# EasyEDA Pro project busmaster-v102.eprj, board base-board
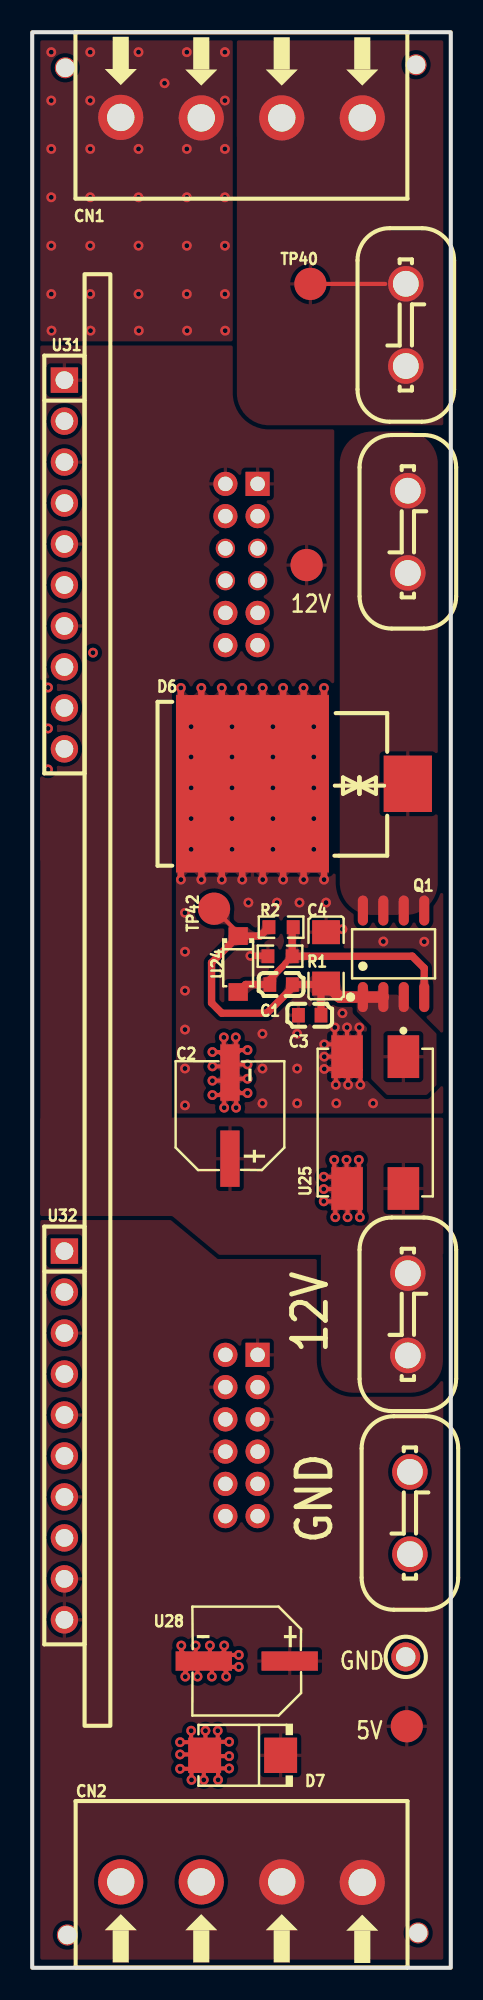
[diagram p5: board, top side]
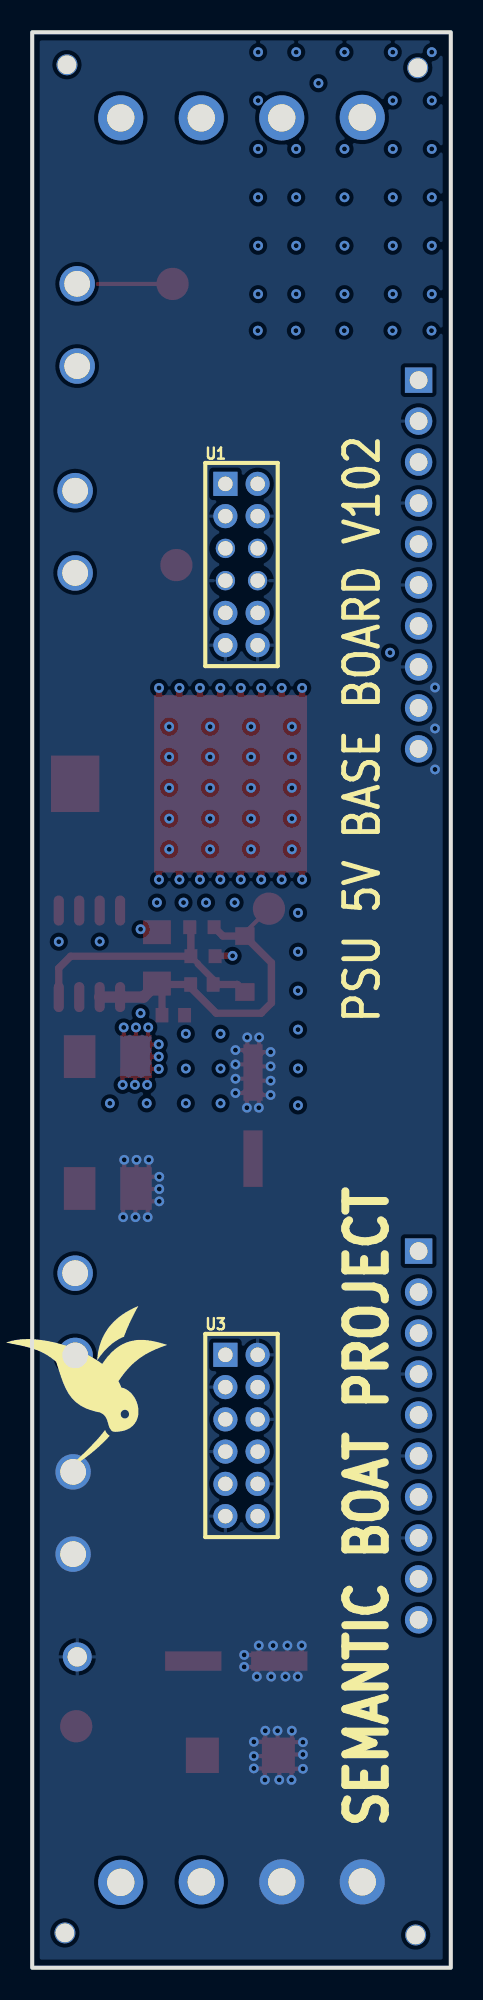
[diagram p6: board, bottom side, seen from below]

Outline 26 x 120 mm; copper layers: Top Layer, Inner1, Inner2, Bottom Layer. Coordinates in mm from the lower left corner of the outline.
Outline path: rectangle 0,120 26,0
Stack: Top Layer 0.07mm Outer layer thickness 1oz / Dielectric1 0.2104mm 7628 RC49% 8.6mil / Inner1 0.0152mm Inner layer thickness / Dielectric2 1.065mm 1.1mm H/HOZ Copper / Inner2 0.0152mm Inner layer thickness / Dielectric3 0.2104mm 7628 RC49% 8.6mil / Bottom Layer 0.07mm Outer layer thickness 1oz

## Design rules (mm)
template: Custom Config
spacing copperThickness1oz: track to track 0.102, other pairs 0.152 to 0.3
spacing copperThickness2oz (default): track to track 0.203, other pairs 0.152 to 0.3
spacing copperThicknessInner0.5oz: track to track 0.089, other pairs 0.152 to 0.3
track width copperThickness1oz: min 0.102, default 0.254, max 2.54
track width copperThickness2oz (default): min 0.203, default 0.254, max 2.54
track width copperThickness0.5oz: min 0.089, default 0.254, max 2.54
differential pair differentialPair (default): width min 0.127, default 0.254, max 2.54; gap min 0.152, default 0.152
via viaSize (default): diameter min 0.3, default 0.61, max 10; hole min 0.2, default 0.305, max 6.3

## Placement (name value [footprint] x y rotation side)
C1  100nF  [C0603]  15.46 60.96 180 top
C2  100uF  [CAP-SMD_BD6.3-L6.6-W6.6-LS7.6-RD]  12.28 52.83 90 top
C3  100nF  [C0603]  17.24 59.06 180 top
C4  10uF  [C1206]  18.25 62.61 270 top
CN1  WJ128V-5.0-4P  [CONN-TH_4P-P5.00_WJ128V-4P-5.0-14-00A]  13 114.71 180 top
CN2  WJ128V-5.0-4P  [CONN-TH_4P-P5.00_WJ128V-4P-5.0-14-00A]  13 5.31 0 top
D6  SM8S20CA  [DO-218AB_L13.5-W8.4-LS15.5-BI]  18.5 73.41 0 top
D7  SMBJ5.0A  [SMB_L4.6-W3.6-LS5.3-RD]  13.07 13.17 180 top
NOREF  -  [Pad_e17]  2.06 117.8 270 top
NOREF#2  -  [Pad_e16]  23.97 2.16 90 top
NOREF#3  -  [Pad_e19]  23.84 117.98 180 top
NOREF#4  -  [Pad_e14]  2.18 2.03 0 top
Q1  IRF7240TRPBF-JSM  [SOIC-8_L4.9-W4.0-P1.27-LS6.0-BL]  22.44 62.86 0 top
R1  47kΩ  [R0603]  15.39 62.71 0 top
R2  100kΩ  [R0603]  15.46 64.52 180 top
TP8  RH-5004  [TESTPOINT_TH_BD2.5-D1.2]  23.2 19.27 0 top
TP38  -  [Test-Point-0.5mm]  17.04 86.97 0 top
TP39  -  [Test-Point-0.5mm]  23.27 14.97 0 top
TP40  -  [Test-Point-0.5mm]  17.28 104.4 0 top
TP42  -  [Test-Point-0.5mm]  11.29 65.66 0 top
U1  2005FV-2x6P  [HDR-TH_12P-P2.00-V-F-R2-C6-S2.00]  13 87 270 bottom
U3  2005FV-2x6P  [HDR-TH_12P-P2.00-V-F-R2-C6-S2.00#2]  13 33 270 bottom
U4  G630-09-3T  [CONN-TH_2P-L8.2-W0.8-P5.10]  23.21 101.85 270 top
U5  G630-09-3T  [CONN-TH_2P-L8.2-W0.8-P5.10]  23.33 89.03 90 top
U24  BZT52C15  [SOD-123_L2.7-W1.6-LS3.8-RD]  12.79 62.23 270 top
U25  ACM9070-701-2PL-TL01  [FILTER-SMD_4P-L9.0-W7.0-TL]  21.31 52.4 270 top
U28  330uF  [CAP-SMD_BD6.3-L6.6-W6.6-LS7.4-FD]  13.32 19.01 180 top
U31  PM254-1-10-Z-8.5  [HDR-TH_10P-P2.54-V-F]  2 87 270 top
U32  PM254-1-10-Z-8.5  [HDR-TH_10P-P2.54-V-F]  2 33 270 top
U33  G630-09-3T  [CONN-TH_2P-L8.2-W0.8-P5.10]  23.33 40.51 90 top
U34  G630-09-3T  [CONN-TH_2P-L8.2-W0.8-P5.10]  23.46 28.19 90 top

## Footprints (pads in the part's own frame, mm; a bottom-side part is the same pattern mirrored in y, then rotated)
C0603
  rect 0.8x0.9 smd: 1(-0.7,0) 2(0.7,0)
C1206
  rect 1.485x1.728 smd: 1(-1.593,0) 2(1.593,0)
CAP-SMD_BD6.3-L6.6-W6.6-LS7.4-FD
  rect 3.5x1.2 smd: 1(-2.67,0) 2(2.67,0)
CAP-SMD_BD6.3-L6.6-W6.6-LS7.6-RD
  rect 3.5x1.2 smd: 1(-2.67,0) 2(2.67,0)
CONN-TH_2P-L8.2-W0.8-P5.10
  round 2.2 hole 1.6: 1(-2.55,0) 2(2.55,0)
CONN-TH_4P-P5.00_WJ128V-4P-5.0-14-00A
  round 2.8 hole 1.7: 1(-7.5,0.015) 2(-2.5,0.015) 3(2.5,0.015) 4(7.5,-0.015)
DO-218AB_L13.5-W8.4-LS15.5-BI
  rect 9.5x11 smd: 1(-4.825,0)
  rect 3x3.5 smd: 2(4.825,0)
FILTER-SMD_4P-L9.0-W7.0-TL
  rect 2.65x1.96 smd: 1(-4.088,1.75) 2(-4.088,-1.75) 3(4.088,-1.75) 4(4.088,1.75)
HDR-TH_10P-P2.54-V-F
  rect 1.575x1.7 hole 1.1: 1(-11.43,0)
  round 1.7 hole 1.1: 2(-8.89,0) 3(-6.35,0) 4(-3.81,0) 5(-1.27,0) 6(1.27,0) 7(3.81,0) 8(6.35,0) 9(8.89,0) 10(11.43,0)
HDR-TH_12P-P2.00-V-F-R2-C6-S2.00
  rect 1.5x1.5 hole 0.9: 1(-5,-1)
  round 1.5 hole 0.9: 2(-5,1) 3(-3,-1) 4(-3,1) 9(3,-1) 10(3,1) 11(5,-1) 12(5,1)
  round 1.2 hole 0.9: 5(-1,-1) 6(-1,1) 7(1,-1) 8(1,1)
HDR-TH_12P-P2.00-V-F-R2-C6-S2.00#2
  rect 1.5x1.5 hole 0.9: 1(-5,-1)
  round 1.5 hole 0.9: 2(-5,1) 3(-3,-1) 4(-3,1) 5(-1,-1) 6(-1,1) 7(1,-1) 8(1,1) 9(3,-1) 10(3,1) 11(5,-1) 12(5,1)
Pad_e14
  round 1.3 hole 1.152: 1(0,0)
Pad_e16
  round 1.3 hole 1.152: 1(0,0)
Pad_e17
  round 1.3 hole 1.152: 1(0,0)
Pad_e19
  round 1.3 hole 1.152: 1(0,0)
R0603
  rect 0.806x0.864 smd: 1(-0.753,0) 2(0.753,0)
SMB_L4.6-W3.6-LS5.3-RD
  rect 2.047x2.192 smd: 1(-2.361,0) 2(2.361,0)
SOD-123_L2.7-W1.6-LS3.8-RD
  rect 1.1x1.2 smd: 1(-1.735,0) 2(1.735,0)
SOIC-8_L4.9-W4.0-P1.27-LS6.0-BL
  oval 0.63x1.865 smd: 1(-1.905,-2.683) 2(-0.635,-2.683) 3(0.635,-2.683) 4(1.905,-2.683) 5(1.905,2.683) 6(0.635,2.683) 7(-0.635,2.683) 8(-1.905,2.683)
Test-Point-0.5mm
  round 2 smd: 1(0,0)
TESTPOINT_TH_BD2.5-D1.2
  round 1.8 hole 1.2: 1(0,0)

## Nets
As in the schematic.

Pads without a net: NOREF 1; NOREF#2 1; NOREF#3 1; NOREF#4 1; U3 9 12

## Via types
v1: diameter 0.61, hole 0.305, Top Layer to Bottom Layer, 149 vias

## Routing (per net, layer and track width the routed paths; a pad name or vN(x,y) marks a point on that pad's centre or on a via; arc(x,y) is an arc through that point)
GND: length 49.5
  Top Layer w0.254: v1(13.38,55.12) 12.67,55.12 12.66,55.12 ; v1(9.9,11.65) 9.9,12.36 9.87,12.33 v1(9.19,12.33) ; 18.83,49.04 U25.3 20.28,49.04 v1(20.28,50.09) ; 18.83,49.04 18.76,49.11 18.76,49.4 ; 18.83,49.04 v1(18.11,49.04) ; 10.15,19.01 9.9,19.01 9.26,19.65 v1(9.26,19.98) ; 10.15,19.01 U28.2 ; 10.15,19.01 9.51,18.38 9.51,18.06 v1(9.51,18.05) ; v1(11.93,19.98) 11.93,19.65 11.67,19.39 v1(12.83,19.39) ; v1(11.92,53.32) 11.92,54.38 11.65,54.11 v1(11.19,54.11) ; 10.71,13.17 10.66,13.12 v1(10.66,11.65) ; 10.71,13.17 10.76,13.22 ; 10.71,13.17 10.66,13.22 v1(9.19,13.22) ; 10.71,13.17 10.76,13.12 v1(12.23,13.12) ; v1(19.52,50.09) 19.52,48.64 18.76,49.4 ; v1(10.27,18.05) 10.27,18.63 U28.2 ; 18.76,49.4 v1(18.76,50.09) ; v1(13.38,56.9) 12.92,56.9 12.77,56.75 12.64,56.88 v1(12.64,57.68) ; v1(12.83,18.65) 11.77,18.65 12.05,18.38 v1(12.05,18.05) ; v1(11.52,14.7) 11.52,13.99 ; 11.52,13.99 11.55,14.01 v1(12.23,14.01) ; 11.52,13.99 10.76,13.22 ; v1(9.87,14.7) 9.87,14.01 9.9,13.99 v1(9.19,13.99) ; 10.76,13.22 v1(10.76,14.7) ; U28.2 10.15,19.52 v1(10.15,19.98) ; U28.2 11.04,19.4 v1(11.04,19.98) ; U28.2 11.16,18.51 v1(11.16,18.05) ; v1(11.19,55.89) 11.9,55.89 C2.2 11.78,55 v1(11.19,55) ; v1(13.38,56.01) 12.79,56.01 12.77,55.99 ; 18.83,47.58 18.76,47.52 v1(18.11,47.52) ; v1(11.55,11.65) 11.55,12.33 11.52,12.36 v1(12.23,12.36) ; v1(12.66,53.32) 12.66,54.48 12.92,54.23 v1(13.38,54.23) ; v1(18.11,48.28) 19.52,48.28 ; v1(18.83,46.53) 18.83,47.12 ; v1(19.59,46.53) 19.59,48.28 20.35,47.52 v1(20.35,46.53) ; v1(11.19,56.78) 11.2,56.77 11.65,56.77 11.78,56.64 11.9,56.77 v1(11.9,57.68)
  vias: v1(0.98,79.38) v1(0.98,76.83) v1(0.98,74.3)
GND_IN: length 84.4
  Top Layer w0.254: 18.13,68.96 16.86,70.23 ; v1(19.62,54.74) 19.62,56.42 20.38,55.66 v1(20.38,54.74) ; v1(19.56,58.3) 19.56,56.74 ; 19.56,56.74 U25.2 ; 19.56,56.74 18.79,57.5 ; v1(18.14,55.72) 18.79,55.72 18.86,55.79 v1(18.86,54.74) ; 18.79,57.5 18.79,57.25 v1(18.14,57.25) ; 18.79,57.5 v1(18.79,58.3) ; 9.24,68.96 D6.1 ; v1(20.32,58.3) 20.32,57.25 U25.2 ; 15.59,71.5 14.32,72.77 ; 16.85,76.58 18.12,77.85 ; 11.77,75.31 13.04,74.04 ; U25.2 v1(18.14,56.49) ; 9.23,77.85 10.5,76.58
  Top Layer w0.4: 18.12,77.85 v1(18.12,79.35) ; v1(10.51,67.46) 10.51,70.23 ; v1(11.77,79.35) 11.77,75.31 ; v1(13.05,67.46) 13.05,72.77 ; v1(16.85,79.35) 16.85,76.58 ; v1(11.78,67.46) 11.78,71.5 ; v1(9.23,79.35) 9.23,77.85 ; 16.86,70.23 v1(16.86,67.46) ; 10.5,76.58 v1(10.5,79.35) ; 14.32,72.77 v1(14.32,67.46) ; v1(15.59,67.46) 15.59,71.5 ; v1(9.24,67.46) 9.24,68.96 ; v1(18.13,67.46) 18.13,68.96 ; v1(15.58,79.35) 15.58,75.31 ; 13.04,74.04 v1(13.04,79.35) ; v1(14.31,79.35) 14.31,74.04
  Top Layer w0.406: R1.1 14.62,62.74 v1(13.55,62.74)
  vias: v1(1.18,118.77) v1(1.18,115.77) v1(1.18,112.77) v1(1.18,109.77) v1(1.18,106.77) v1(1.18,103.77) v1(1.2,101.5) v1(3.6,118.77) v1(3.6,115.77) v1(3.6,112.77) v1(3.6,109.77) v1(3.6,106.77) v1(3.6,103.77) v1(3.62,101.5) v1(6.6,118.77) v1(6.6,112.77) v1(6.6,109.77) v1(6.6,106.77) v1(6.6,103.77) v1(6.62,101.5) v1(8.22,116.84) v1(9.49,65.41) v1(9.49,62.99) v1(9.49,60.58) v1(9.49,58.17) v1(9.49,55.75) v1(9.49,53.47) v1(9.6,118.77) v1(9.6,112.77) v1(9.6,109.77) v1(9.6,106.77) v1(9.6,103.77) v1(9.62,101.5) v1(9.87,76.95) v1(9.87,75.07) v1(9.87,73.15) v1(9.87,71.25) v1(9.87,69.34) v1(11.97,118.77) v1(11.97,115.77) v1(11.97,112.77) v1(11.97,109.77) v1(11.97,106.77) v1(11.97,103.77) v1(11.99,101.5) v1(12.41,76.95) v1(12.41,75.07) v1(12.41,73.15) v1(12.41,71.25) v1(12.41,69.34) v1(13.43,66.04) v1(14.3,57.91) v1(14.3,55.75) v1(14.3,53.59) v1(14.95,76.95) v1(14.95,75.07) v1(14.95,73.15) v1(14.95,71.25) v1(14.95,69.34) v1(15.21,66.04) v1(16.46,57.91) v1(16.46,55.75) v1(16.46,53.59) v1(16.6,66.04) v1(17.49,76.95) v1(17.49,75.07) v1(17.49,73.15) v1(17.49,71.25) v1(17.49,69.34) v1(18.25,66.04) v1(18.89,53.59) v1(19.27,64.39) v1(19.27,59.18) v1(21.17,53.59) v1(21.81,63.63) v1(24.35,63.61)
SMB_ALERT: length 44.5
  Inner1 w0.254: U32.1 1.36,45.07 1.36,71.63 8.22,78.49 8.22,80.73 11.49,84 U1.10
SMB_CLK: length 29.7
  Inner1 w0.254: U31.9 3.15,78.11 5.93,80.9 5.93,88.65 10.63,93.34 14.82,93.34 15.21,92.96 15.21,89.2 U1.5
SMB_DATA: length 37.8
  Inner1 w0.254: v1(3.78,81.53) 4.16,81.92 4.16,88.65 9.36,93.85 14.96,93.85 15.71,93.1 15.71,85.71 U1.9
  Inner2 w0.254: v1(3.78,81.53) 3.78,77.34 U31.10
STACK_ENABLE: length 51.3
  Inner1 w0.254: U1.6 11.97,88 7.59,83.62 7.59,78.87 0.73,72.01 0.73,43.16 U32.2
$1N44887: length 4.6
  Top Layer w0.254: TP40.1 21.93,104.4
$1N46667: length 16.6
  Top Layer w0.355: 15.71,62.23 15.71,62.28 R1.2
  Top Layer w0.406: C1.2 14.76,61.28 15.71,62.23
  Top Layer w0.457: R2.1 16.15,64.45 R1.2 23.61,62.71 24.35,61.98 Q1.4 ; C1.2 13.26,60.96 U24.2
$1N61426: length 23.4
  Top Layer w0.254: U24.1 12.79,64.16 TP42.1
  Top Layer w0.457: C3.1 17.94,60.7 18.19,60.96 C1.1 16.16,60.77 14.57,59.18 11.78,59.18 11.14,59.82 11.14,62.31 U24.1 14.15,63.97 R2.2
  Top Layer w0.711: C4.2 19.09,60.18 Q1.1 Q1.2

## Copper pours and planes (outline as drawn; the poured copper is in the pictures)
+5V on Top Layer: -0.54,-0.63 27.14,-0.63 27.02,43.94 11.52,43.94 8.6,46.36 -0.42,46.36
+12V on Top Layer: -0.86,41.15 -0.86,52.7 27.59,52.7 27.59,41.15
+12V on Top Layer: -1.43,100.58 18.76,100.58 18.76,68.58 -1.43,68.58
+12V on Top Layer: -0.86,79.95 8.67,79.95 8.67,46.61 -0.86,46.61
+12V on Top Layer: 17.93,46.01 25.51,46.01 25.51,35.65 17.93,35.65
GND on Bottom Layer: -4.86,123.83 28.79,123.83 28.79,-2.79 -4.86,-2.79
GND on Inner1: -2.57,51.31 26.63,51.31 26.63,-2.29 -2.57,-2.29
GND on Inner1: -1.05,74.3 4.36,74.3 8.6,78.58 8.6,80.01 9.36,80.77 14.32,80.77 15.84,82.3 15.84,93.22 14.95,94.11 9.11,94.11 3.39,99.82 -0.8,99.82 -1.05,99.57
GND on Inner2: -2.57,51.31 26.63,51.31 26.63,-2.29 -2.57,-2.29
GND_IN on Top Layer: 7.97,68.33 27.14,68.33 27.14,51.94 7.97,51.94
GND_IN on Top Layer: -4.48,122.81 29.68,122.81 29.68,100.71 -4.48,100.71
GND_IN on Inner1: -3.08,123.7 27.02,123.7 27.02,51.94 -3.08,51.94
GND_IN on Inner2: -3.08,123.7 27.02,123.7 27.02,51.94 -3.08,51.94
$1N44887 on Top Layer: 28.07,97.63 28.05,97.35 27.99,97.07 27.89,96.8 27.75,96.55 27.58,96.32 27.38,96.12 27.15,95.95 26.9,95.81 26.63,95.71 26.35,95.65 26.07,95.63 14.71,95.63 14.43,95.65 14.15,95.71 13.88,95.81 13.63,95.95 13.4,96.12 13.2,96.32 13.03,96.55 12.89,96.8 12.79,97.07 12.73,97.35 12.71,97.63 12.71,120.68 12.73,120.97 12.79,121.25 12.89,121.52 13.03,121.77 13.2,121.99 13.4,122.2 13.63,122.37 13.88,122.5 14.15,122.6 14.43,122.66 14.71,122.68 26.07,122.68 26.35,122.66 26.63,122.6 26.9,122.5 27.15,122.37 27.38,122.2 27.58,121.99 27.75,121.77 27.89,121.52 27.99,121.25 28.05,120.97 28.07,120.68
$1N44887 on Top Layer: 20.87,117.73 21.16,117.71 21.44,117.65 21.7,117.55 21.95,117.42 22.18,117.25 22.38,117.04 22.56,116.82 22.69,116.56 22.79,116.3 22.85,116.02 22.87,115.73 22.87,113.65 22.85,113.37 22.79,113.09 22.69,112.82 22.56,112.57 22.38,112.34 22.18,112.14 21.95,111.97 21.7,111.83 21.44,111.73 21.16,111.67 20.87,111.65 14.71,111.65 14.43,111.67 14.15,111.73 13.88,111.83 13.63,111.97 13.4,112.14 13.2,112.34 13.03,112.57 12.89,112.82 12.79,113.09 12.73,113.37 12.71,113.65 12.71,115.73 12.73,116.02 12.79,116.3 12.89,116.56 13.03,116.82 13.2,117.04 13.4,117.25 13.63,117.42 13.88,117.55 14.15,117.65 14.43,117.71 14.71,117.73
$1N45787 on Top Layer: 19.11,93.25 19.13,93.53 19.19,93.81 19.29,94.08 19.42,94.33 19.59,94.56 19.8,94.76 20.02,94.93 20.28,95.07 20.54,95.17 20.82,95.23 21.11,95.25 23.19,95.25 23.47,95.23 23.75,95.17 24.02,95.07 24.27,94.93 24.5,94.76 24.7,94.56 24.87,94.33 25.01,94.08 25.11,93.81 25.17,93.53 25.19,93.25 25.19,67.28 25.17,66.99 25.11,66.71 25.01,66.44 24.87,66.19 24.7,65.97 24.5,65.76 24.27,65.59 24.02,65.46 23.75,65.36 23.47,65.3 23.19,65.28 21.11,65.28 20.82,65.3 20.54,65.36 20.28,65.46 20.02,65.59 19.8,65.76 19.59,65.97 19.42,66.19 19.29,66.44 19.19,66.71 19.13,66.99 19.11,67.28
$1N61426 on Top Layer: 21.05,55.1 21.05,58.4 20.16,59.29 20.16,60.33 22.69,60.33 25.11,57.91 25.11,54.72 24.5,54.11 22.04,54.11

Small or netless copper shapes (teardrops, artwork), in the pictures only: 112 on Top Layer, 8 on Inner1, 2 on Inner2

## Text on the board
Bottom Silkscreen Layer: PSU 5V BASE BOARD V102 | SEMANTIC BOAT PROJECT
Top Silkscreen Layer: 12V | GND | 5V
